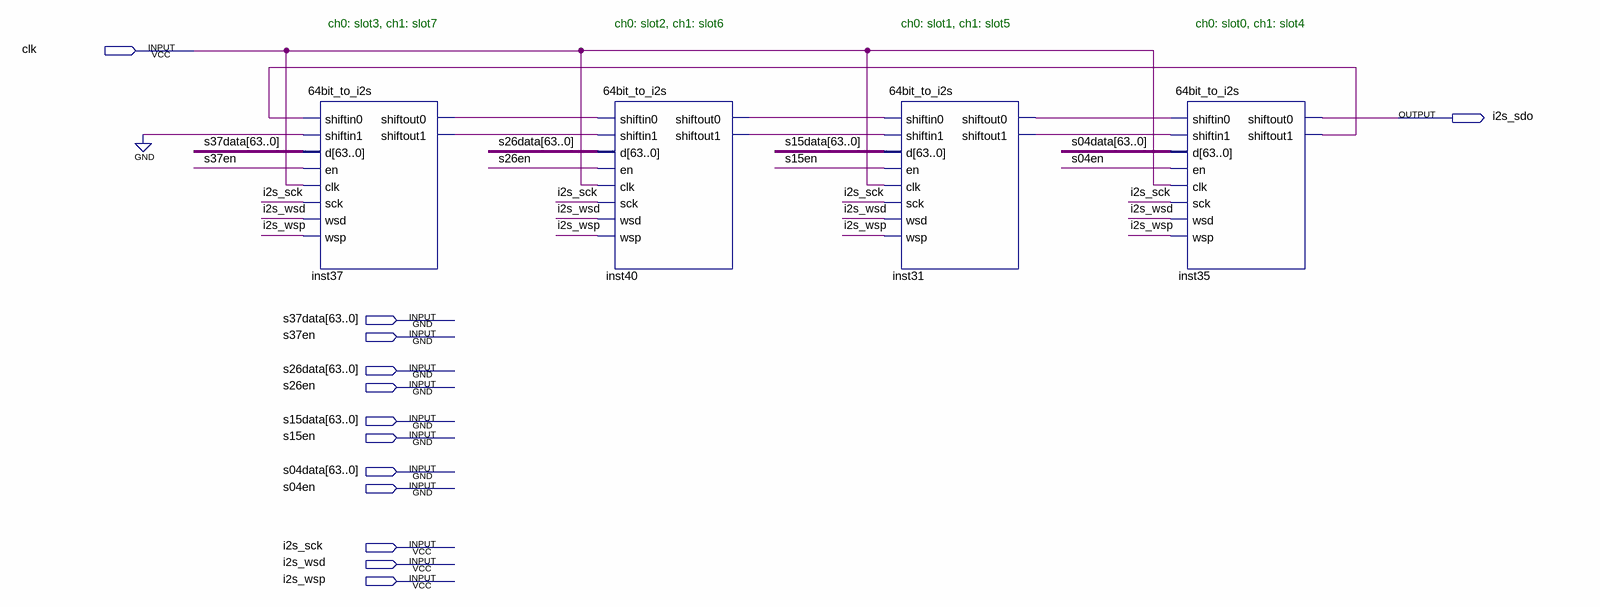
[diagram p0: schematic sheet]
// Quartus schematic i2s_tx_8slot.bdf as structural Verilog: 4 symbols, 13 pins
module i2s_tx_8slot (
  input  clk,
  input  [63:0] s37data,
  input  s37en,
  input  [63:0] s26data,
  input  s26en,
  input  [63:0] s15data,
  input  s15en,
  input  [63:0] s04data,
  input  s04en,
  input  i2s_sck,
  input  i2s_wsd,
  input  i2s_wsp,
  output i2s_sdo
);

  wire inst31_shiftout0, inst31_shiftout1, inst35_shiftout1, inst37_shiftout0, inst37_shiftout1,
       inst40_shiftout0, inst40_shiftout1;

  \64bit_to_i2s  inst37 (
    .shiftin0(inst35_shiftout1), .shiftin1(1'b0), .d(s37data), .en(s37en), .clk(clk), .sck(i2s_sck),
    .wsd(i2s_wsd), .wsp(i2s_wsp), .shiftout0(inst37_shiftout0), .shiftout1(inst37_shiftout1));
  \64bit_to_i2s  inst40 (
    .shiftin0(inst37_shiftout0), .shiftin1(inst37_shiftout1), .d(s26data), .en(s26en), .clk(clk),
    .sck(i2s_sck), .wsd(i2s_wsd), .wsp(i2s_wsp), .shiftout0(inst40_shiftout0), .shiftout1(inst40_shiftout1));
  \64bit_to_i2s  inst31 (
    .shiftin0(inst40_shiftout0), .shiftin1(inst40_shiftout1), .d(s15data), .en(s15en), .clk(clk),
    .sck(i2s_sck), .wsd(i2s_wsd), .wsp(i2s_wsp), .shiftout0(inst31_shiftout0), .shiftout1(inst31_shiftout1));
  \64bit_to_i2s  inst35 (
    .shiftin0(inst31_shiftout0), .shiftin1(inst31_shiftout1), .d(s04data), .en(s04en), .clk(clk),
    .sck(i2s_sck), .wsd(i2s_wsd), .wsp(i2s_wsp), .shiftout0(i2s_sdo), .shiftout1(inst35_shiftout1));

  // Notes on the sheet:
  //   ch0: slot3, ch1: slot7
  //   ch0: slot2, ch1: slot6
  //   ch0: slot1, ch1: slot5
  //   ch0: slot0, ch1: slot4
endmodule
